# EAGLE design untitled (EAGLE 7.2.0)
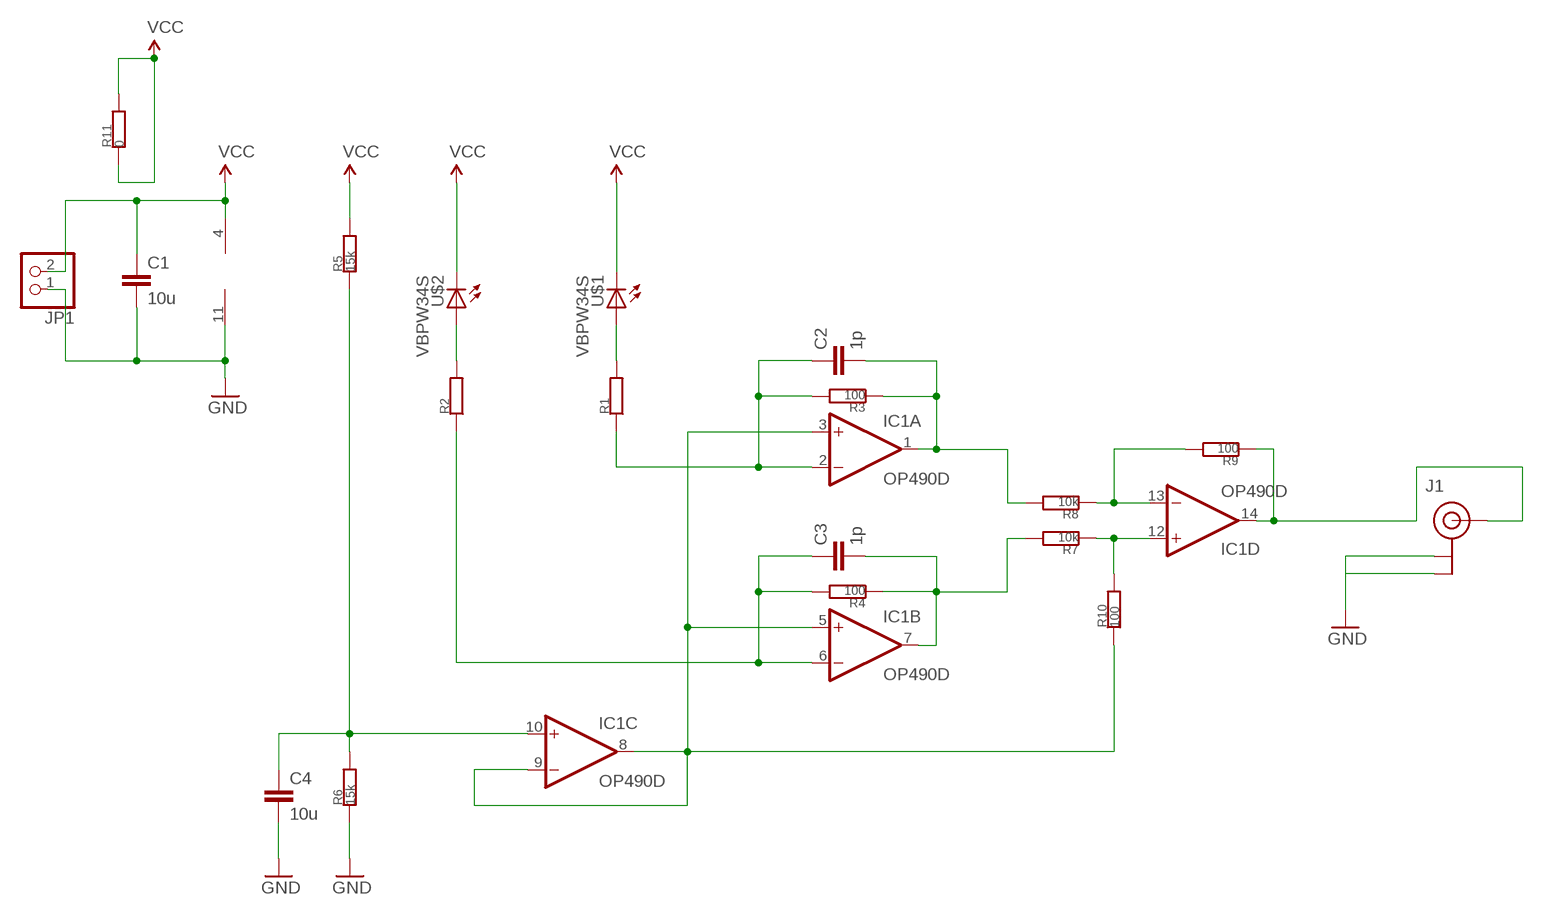
[diagram p0: schematic, sheet 1]

## Parts
C1  10u  CC0805  [C0805]
C2  1p  CC0603  [C0603]
C3  1p  CC0603  [C0603]
C4  10u  CC0805  [C0805]
IC1  OP490D  [SO14]
J1  U.FL  [U.FL]
JP1  PINHD-1X2  [1X02]
R1  R0603  [0603]
R2  R0603  [0603]
R3  100  R0603  [0603]
R4  100  R0603  [0603]
R5  15k  R0603  [0603]
R6  15k  R0603  [0603]
R7  10k  R0603  [0603]
R8  10k  R0603  [0603]
R9  100  R0603  [0603]
R10  100  R0603  [0603]
R11  0  R0603  [0603]
U$1  VBPW34S  [SMD_PIN]
U$2  VBPW34S  [SMD_PIN]

## Nets
GND: C1.2 C4.2 IC1.11(P:V-) J1.P$1(GND) J1.P$2(GND) JP1.1 R6.1
N$1: R1.2 U$1.A
N$2: R2.2 U$2.A
N$3: C2.1 IC1.2(A:-IN) R1.1 R3.2
N$4: C3.1 IC1.6(B:-IN) R2.1 R4.2
N$5: C2.2 IC1.1(A:OUT) R3.1 R8.2
N$6: C3.2 IC1.7(B:OUT) R4.1 R7.2
N$7: C4.1 IC1.10(C:+IN) R5.1 R6.2
N$9: IC1.12(D:+IN) R7.1 R10.2
N$10: IC1.13(D:-IN) R8.1 R9.2
N$11: IC1.14(D:OUT) J1.P$3(SIGNAL) R9.1
N$15: IC1.3(A:+IN) IC1.5(B:+IN) IC1.8(C:OUT) IC1.9(C:-IN) R10.1
VCC: C1.1 IC1.4(P:V+) JP1.2 R5.2 R11.1 R11.2 U$1.K(C) U$2.K(C)

## Library data of the parts
C1-C4 = CasaLibrary:C: Capacitor
IC1 = linear:OP490: OP AMP
J1 = SparkFun-Connectors:U.FL: SMD antenna connector- WRL-09144; PROD_ID: CONN-09193
JP1 = pinhead:PINHD-1X2: PIN HEADER
R1-R11 = CasaLibrary:R
U$1 U$2 = CasaLibrary:VBPW34S

## Board
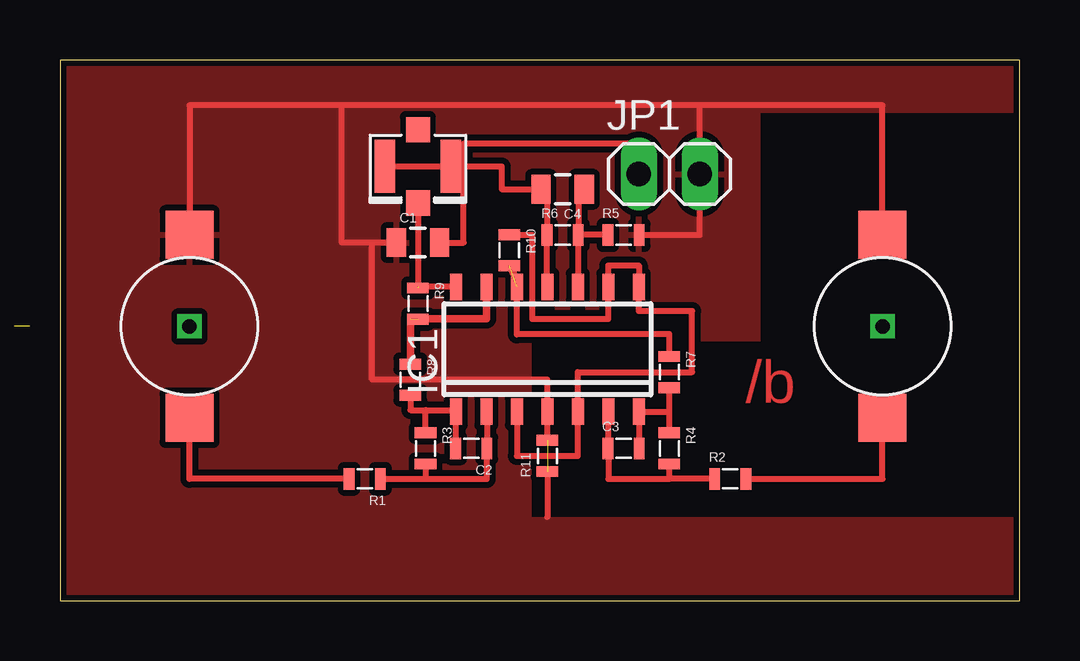
[diagram p1: board, top side]

Size 40 x 22.53 mm. Coordinates in mm from the lower left corner, seen from the top.
Outline: 0,0 40,0 40,22.53 0,22.53 0,0
Copper layers (1*16): Top 0.035mm / dielectric 1.5mm / Bottom 0.035mm
Design rules "new": minimum track width 0.25mm, minimum drill 0.3mm, track to track 0.25mm, track to pad 0.25mm, pad to pad 0.25mm, via to via 0.25mm, smd to smd 0.25mm, copper to edge 0.25mm, drill to drill 0.25mm, minimum pad ring 10mil, minimum via ring 8mil, stop-mask expansion 4mil, vias tented up to drill 0mil, thermal gap 10mil
tRestrict: area 29.2,3.5 to 45.4,20.3; area 45.1,3.5 to 53.7,11.1; area 19.7,3.5 to 29.2,10.8

### Footprints (pad centres in the part's own frame; a part is rotated, then mirrored left to right if it is on the bottom)
C0805 = smd 0.8 x 1.2: 1 -0.9,0; 2 0.9,0
C0603 = smd 0.45 x 0.9: 1 -0.65,0; 2 0.65,0
SO14 = smd 0.5 x 1.1: 1 -3.81,-2.6; 2 -2.54,-2.6; 3 -1.27,-2.6; 4 0,-2.6; 5 1.27,-2.6; 6 2.54,-2.6; 7 3.81,-2.6; 8 3.81,2.6; 9 2.54,2.6; 10 1.27,2.6; 11 0,2.6; 12 -1.27,2.6; 13 -2.54,2.6; 14 -3.81,2.6
U.FL = smd 2.2 x 0.85: P$1 0,1.375; P$2 0,-1.375 | smd 1.05 x 1: P$3 1.525,0; P$4 -1.525,0
1X02 = drill 1.016 long: 1 -1.27,0; 2 1.27,0
0603 = smd 0.45 x 0.9: 1 -0.65,0; 2 0.65,0
SMD_PIN = smd 2 x 2: A -3.81,0; K 3.81,0

### Placement (x,y rotation side)
C1  14.92,14.92 0 top
C2  17.14,6.35 180 top
C3  23.5,6.35 0 top
C4  20.95,17.14 180 top
IC1  20.32,10.48 0 top
J1  14.92,18.1 270 top
JP1  25.4,17.78 0 top
R1  12.7,5.08 180 top
R2  27.94,5.08 0 top
R3  15.24,6.35 270 top
R4  25.4,6.35 270 top
R5  23.5,15.24 0 top
R6  20.95,15.24 0 top
R7  25.4,9.53 270 top
R8  14.61,9.21 270 top
R9  14.92,12.38 270 top
R10  18.73,14.61 270 top
R11  20.32,6.03 90 top
U$1  5.4,11.43 90 top
U$2  34.29,11.43 90 top

### Tracks (layer width: path | path; a pad name or v marks a point on that pad's centre or on a via)
GND
  Top 0.254: IC1.11 20.3,13.08 R6.1 20.3,17.14 C4.2 18.41,17.14 18.41,18.1 16.83,18.1 | 16.83,18.1 J1.P$1 J1.P$2 | C1.2 16.83,14.92 16.83,18.1 | JP1.1 24.13,19.05 16.83,19.05 16.83,18.1
N$1
  Top 0.254: R1.2 5.4,5.08 U$1.A
N$2
  Top 0.254: R2.2 34.29,5.08 U$2.A
N$3
  Top 0.254: IC1.2 17.8,7.88 C2.1 17.8,5.08 15.24,5.08 | R3.2 15.24,5.08 | R1.1 15.24,5.08
N$4
  Top 0.254: IC1.6 22.84,7.88 C3.1 22.86,5.08 25.4,5.08 | 25.4,5.08 R4.2 | R2.1 25.4,5.08
N$5
  Top 0.254: R8.2 14.61,7.94 15.24,7.94 | 15.24,7.94 16.51,7.94 IC1.1 C2.2 | R3.1 15.24,7.94
N$6
  Top 0.254: C3.2 24.14,7.88 IC1.7 25.4,7.88 | 25.4,7.88 R7.2 | R4.1 25.4,7.88
N$7
  Top 0.254: IC1.10 21.61,13.08 R6.2 | R5.1 R6.2 | C4.1 21.61,17.14 R6.2
N$8
  Top 0.305: 18.73,13.97 19.05,13.34
N$9  (1 unrouted)
  Top 0.254: 19.05,11.11 IC1.12 | R7.1 25.4,11.11 19.05,11.11 | 19.05,11.11 19.05,11.1
N$10  (1 unrouted)
  Top 0.305: IC1.13 17.78,11.75 14.61,11.75 R8.1
N$11  (1 unrouted)
  Top 0.254: 16.5,13.08 IC1.14 14.92,13.08 J1.P$3
  Top 0.305: 14.91,13.08 14.92,13.08
N$13  (via drill 0.6)
  other vias: 5.4,11.43
N$14  (via drill 0.6)
  other vias: 34.29,11.43
N$15
  Top 0.254: IC1.3 19.05,6.03 21.59,6.03 IC1.5 21.59,9.53 26.35,9.53 26.35,12.06 24.13,12.06 IC1.8 24.13,13.97 22.86,13.97 IC1.9 22.86,11.75 19.68,11.75 19.68,15.24 R10.1
N$16  (1 unrouted)
VCC  (1 unrouted)
  Top 0.254: 13.02,14.92 13.02,9.21 20.32,9.21 IC1.4 R11.2 | R5.2 26.67,15.24 JP1.2 26.67,20.64 | 26.67,20.64 11.75,20.64 | 11.75,20.64 5.4,20.64 U$1.K | U$2.K 34.29,20.64 26.67,20.64 | 11.75,20.64 11.75,14.92 13.02,14.92 | C1.1 13.02,14.92 | R11.1 20.32,3.49
  pour Top: 0,22.54 0,0 40.63,0 40.63,22.54

### Text on the board
Top: /b